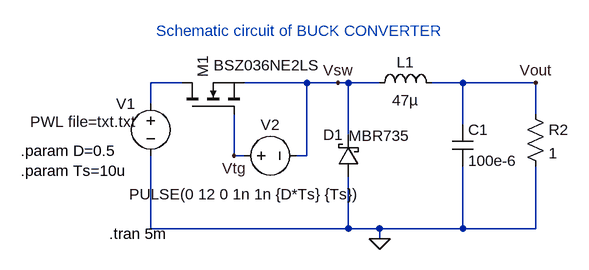
[diagram p0: schematic BuckConverter.asc]
BuckConverter.asc, the LTspice schematic file:
Version 4
SHEET 1 880 680
WIRE -64 0 -112 0
WIRE 128 0 32 0
WIRE 176 0 128 0
WIRE 192 0 176 0
WIRE 240 0 192 0
WIRE 368 0 320 0
WIRE 480 0 368 0
WIRE -112 32 -112 0
WIRE 480 48 480 0
WIRE 368 64 368 0
WIRE 192 80 192 0
WIRE 16 112 16 48
WIRE 32 112 16 112
WIRE 128 112 128 0
WIRE 128 112 112 112
WIRE -112 224 -112 112
WIRE 192 224 192 144
WIRE 192 224 -112 224
WIRE 240 224 192 224
WIRE 368 224 368 128
WIRE 368 224 240 224
WIRE 480 224 480 128
WIRE 480 224 368 224
WIRE 240 240 240 224
FLAG 480 0 Vout
FLAG 16 112 Vtg
FLAG 176 0 Vsw
FLAG 240 240 0
SYMBOL voltage -112 16 M0
WINDOW 3 24 44 Left 2
WINDOW 123 0 0 Left 2
WINDOW 39 0 0 Left 2
SYMATTR Value PWL file=txt.txt
SYMATTR InstName V1
SYMBOL ind 336 16 M270
WINDOW 0 32 56 VTop 2
WINDOW 3 5 56 VBottom 2
SYMATTR InstName L1
SYMATTR Value 47µ
SYMATTR SpiceLine Rser=10m
SYMBOL res 464 32 R0
SYMATTR InstName R2
SYMATTR Value 1
SYMBOL voltage 16 112 R270
WINDOW 0 32 56 VTop 2
WINDOW 3 -44 17 VBottom 2
WINDOW 123 0 0 Left 2
WINDOW 39 0 0 Left 2
SYMATTR InstName V2
SYMATTR Value PULSE(0 12 0 1n 1n {D*Ts} {Ts})
SYMBOL cap 352 64 R0
SYMATTR InstName C1
SYMATTR Value 100e-6
SYMBOL schottky 208 144 R180
WINDOW 0 24 64 Left 2
WINDOW 3 -78 63 Left 2
SYMATTR InstName D1
SYMATTR Value MBR735
SYMATTR Description Diode
SYMATTR Type diode
SYMBOL nmos -64 48 R270
WINDOW 3 75 49 VRight 2
SYMATTR InstName M1
SYMATTR Value BSZ036NE2LS
TEXT -312 104 Left 2 !.param D=0.5\n.param Ts=10u
TEXT -176 232 Left 2 !.tran 5m
TEXT -104 -80 Left 2 ;Schematic circuit of BUCK CONVERTER

The netlist it stands for:
* BuckConverter.asc
V1 N001 0 PWL file=txt.txt
L1 Vout Vsw 47µ Rser=10m
R2 Vout 0 1
V2 Vtg Vsw PULSE(0 12 0 1n 1n {D*Ts} {Ts})
C1 Vout 0 100e-6
D1 0 Vsw MBR735
M1 N001 Vtg Vsw Vsw BSZ036NE2LS
.model D D
.lib standard.dio
.model NMOS NMOS
.model PMOS PMOS
.lib standard.mos
.param D=0.5
.param Ts=10u
.tran 5m
* Schematic circuit of BUCK CONVERTER
.backanno
.end